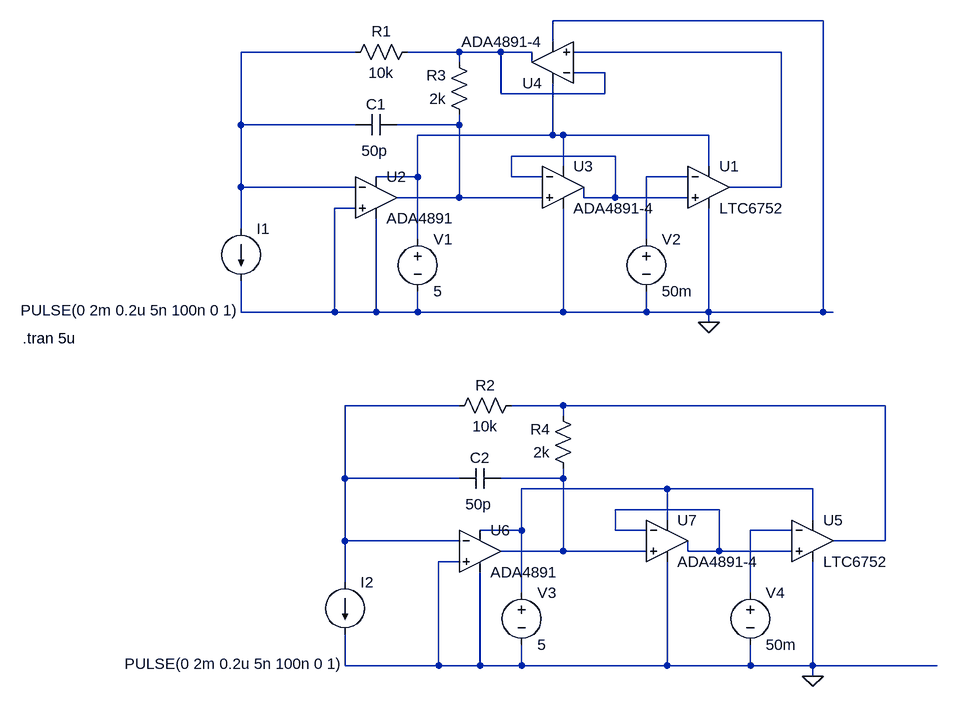
[diagram p0: schematic LTC6752_TOT withbuffer.asc]
LTC6752_TOT withbuffer.asc, the LTspice schematic file:
Version 4
SHEET 1 880 788
WIRE 624 -240 208 -240
WIRE 208 -208 208 -240
WIRE -96 -192 -272 -192
WIRE 64 -192 -16 -192
WIRE 128 -192 64 -192
WIRE 176 -192 128 -192
WIRE 560 -192 240 -192
WIRE 64 -176 64 -192
WIRE 176 -176 176 -192
WIRE 288 -160 240 -160
WIRE 128 -128 128 -192
WIRE 288 -128 288 -160
WIRE 288 -128 128 -128
WIRE -272 -80 -272 -192
WIRE -96 -80 -272 -80
WIRE 64 -80 64 -96
WIRE 64 -80 -32 -80
WIRE 208 -64 208 -144
WIRE 208 -64 0 -64
WIRE 224 -64 208 -64
WIRE 448 -64 224 -64
WIRE 304 -32 144 -32
WIRE 224 -16 224 -64
WIRE 448 -16 448 -64
WIRE 0 0 0 -64
WIRE 0 0 -64 0
WIRE 144 0 144 -32
WIRE 192 0 144 0
WIRE 416 0 352 0
WIRE -272 16 -272 -80
WIRE -96 16 -272 16
WIRE 560 16 560 -192
WIRE 560 16 480 16
WIRE 64 32 64 -80
WIRE 64 32 -32 32
WIRE 192 32 64 32
WIRE 256 32 256 16
WIRE 304 32 304 -32
WIRE 304 32 256 32
WIRE 416 32 304 32
WIRE -96 48 -128 48
WIRE -272 80 -272 16
WIRE 0 96 0 0
WIRE 352 96 352 0
WIRE -272 208 -272 160
WIRE -128 208 -128 48
WIRE -128 208 -272 208
WIRE -64 208 -64 64
WIRE -64 208 -128 208
WIRE 0 208 0 176
WIRE 0 208 -64 208
WIRE 224 208 224 48
WIRE 224 208 0 208
WIRE 352 208 352 176
WIRE 352 208 224 208
WIRE 448 208 448 48
WIRE 448 208 352 208
WIRE 624 208 624 -240
WIRE 624 208 448 208
WIRE 640 208 624 208
WIRE 448 224 448 208
WIRE 64 352 -112 352
WIRE 224 352 144 352
WIRE 720 352 224 352
WIRE 224 368 224 352
WIRE -112 464 -112 352
WIRE 64 464 -112 464
WIRE 224 464 224 448
WIRE 224 464 128 464
WIRE 384 480 160 480
WIRE 608 480 384 480
WIRE 464 512 304 512
WIRE 384 528 384 480
WIRE 608 528 608 480
WIRE 160 544 160 480
WIRE 160 544 96 544
WIRE 304 544 304 512
WIRE 352 544 304 544
WIRE 576 544 512 544
WIRE -112 560 -112 464
WIRE 64 560 -112 560
WIRE 720 560 720 352
WIRE 720 560 640 560
WIRE 224 576 224 464
WIRE 224 576 128 576
WIRE 352 576 224 576
WIRE 416 576 416 560
WIRE 464 576 464 512
WIRE 464 576 416 576
WIRE 576 576 464 576
WIRE 64 592 32 592
WIRE -112 624 -112 560
WIRE 160 640 160 544
WIRE 512 640 512 544
WIRE -112 752 -112 704
WIRE 32 752 32 592
WIRE 32 752 -112 752
WIRE 96 752 96 608
WIRE 96 752 32 752
WIRE 160 752 160 720
WIRE 160 752 96 752
WIRE 384 752 384 592
WIRE 384 752 160 752
WIRE 512 752 512 720
WIRE 512 752 384 752
WIRE 608 752 608 592
WIRE 608 752 512 752
WIRE 800 752 608 752
WIRE 608 768 608 752
FLAG 448 224 0
FLAG 608 768 0
SYMBOL Comparators\\LTC6752 448 -48 R0
SYMATTR InstName U1
SYMBOL current -272 80 R0
WINDOW 123 0 0 Left 0
WINDOW 39 0 0 Left 0
WINDOW 3 -339 125 Left 2
SYMATTR Value PULSE(0 2m 0.2u 5n 100n 0 1)
SYMATTR InstName I1
SYMBOL OpAmps\\ADA4891 -64 -32 R0
SYMATTR InstName U2
SYMBOL cap -32 -96 R90
WINDOW 0 0 32 VBottom 2
WINDOW 3 40 34 VTop 2
SYMATTR InstName C1
SYMATTR Value 50p
SYMBOL res 0 -208 R90
WINDOW 0 0 56 VBottom 2
WINDOW 3 32 56 VTop 2
SYMATTR InstName R1
SYMATTR Value 10k
SYMBOL voltage 0 80 R0
WINDOW 123 0 0 Left 0
WINDOW 39 0 0 Left 0
SYMATTR InstName V1
SYMATTR Value 5
SYMBOL voltage 352 80 R0
WINDOW 123 0 0 Left 0
WINDOW 39 0 0 Left 0
SYMATTR InstName V2
SYMATTR Value 50m
SYMBOL res 80 -80 R180
WINDOW 0 36 76 Left 2
WINDOW 3 36 40 Left 2
SYMATTR InstName R3
SYMATTR Value 2k
SYMBOL OpAmps\\ADA4891-4 224 -48 R0
SYMATTR InstName U3
SYMBOL OpAmps\\ADA4891-4 208 -112 R180
SYMATTR InstName U4
SYMBOL Comparators\\LTC6752 608 496 R0
SYMATTR InstName U5
SYMBOL current -112 624 R0
WINDOW 123 0 0 Left 0
WINDOW 39 0 0 Left 0
WINDOW 3 -339 125 Left 2
SYMATTR Value PULSE(0 2m 0.2u 5n 100n 0 1)
SYMATTR InstName I2
SYMBOL OpAmps\\ADA4891 96 512 R0
SYMATTR InstName U6
SYMBOL cap 128 448 R90
WINDOW 0 0 32 VBottom 2
WINDOW 3 40 34 VTop 2
SYMATTR InstName C2
SYMATTR Value 50p
SYMBOL res 160 336 R90
WINDOW 0 0 56 VBottom 2
WINDOW 3 32 56 VTop 2
SYMATTR InstName R2
SYMATTR Value 10k
SYMBOL voltage 160 624 R0
WINDOW 123 0 0 Left 0
WINDOW 39 0 0 Left 0
SYMATTR InstName V3
SYMATTR Value 5
SYMBOL voltage 512 624 R0
WINDOW 123 0 0 Left 0
WINDOW 39 0 0 Left 0
SYMATTR InstName V4
SYMATTR Value 50m
SYMBOL res 240 464 R180
WINDOW 0 36 76 Left 2
WINDOW 3 36 40 Left 2
SYMATTR InstName R4
SYMATTR Value 2k
SYMBOL OpAmps\\ADA4891-4 384 496 R0
SYMATTR InstName U7
TEXT -608 248 Left 2 !.tran 5u

The netlist it stands for:
* LTC6752_TOT withbuffer.asc
XU1 N006 N007 N005 0 N003 LTC6752  ; pins In+ In- V+ V- OUT
I1 N001 0 PULSE(0 2m 0.2u 5n 100n 0 1)
XU2 0 N001 N005 0 N004 ADA4891-1  ; pins In+ In- V+ V- OUT
C1 N004 N001 50p
R1 N002 N001 10k
V1 N005 0 5
V2 N007 0 50m
R3 N004 N002 2k
XU3 N004 N006 N005 0 N006 ADA4891-4  ; pins In+ In- V+ V- OUT
XU4 N003 N002 N005 0 N002 ADA4891-4  ; pins In+ In- V+ V- OUT
XU5 N012 N013 N011 0 N009 LTC6752  ; pins In+ In- V+ V- OUT
I2 N008 0 PULSE(0 2m 0.2u 5n 100n 0 1)
XU6 0 N008 N011 0 N010 ADA4891-1  ; pins In+ In- V+ V- OUT
C2 N010 N008 50p
R2 N009 N008 10k
V3 N011 0 5
V4 N013 0 50m
R4 N010 N009 2k
XU7 N010 N012 N011 0 N012 ADA4891-4  ; pins In+ In- V+ V- OUT
.tran 5u
.lib LTC7.lib
.lib ADA4891-1.lib
.backanno
.end